# Altium project USB-TO-UART.PrjPCB
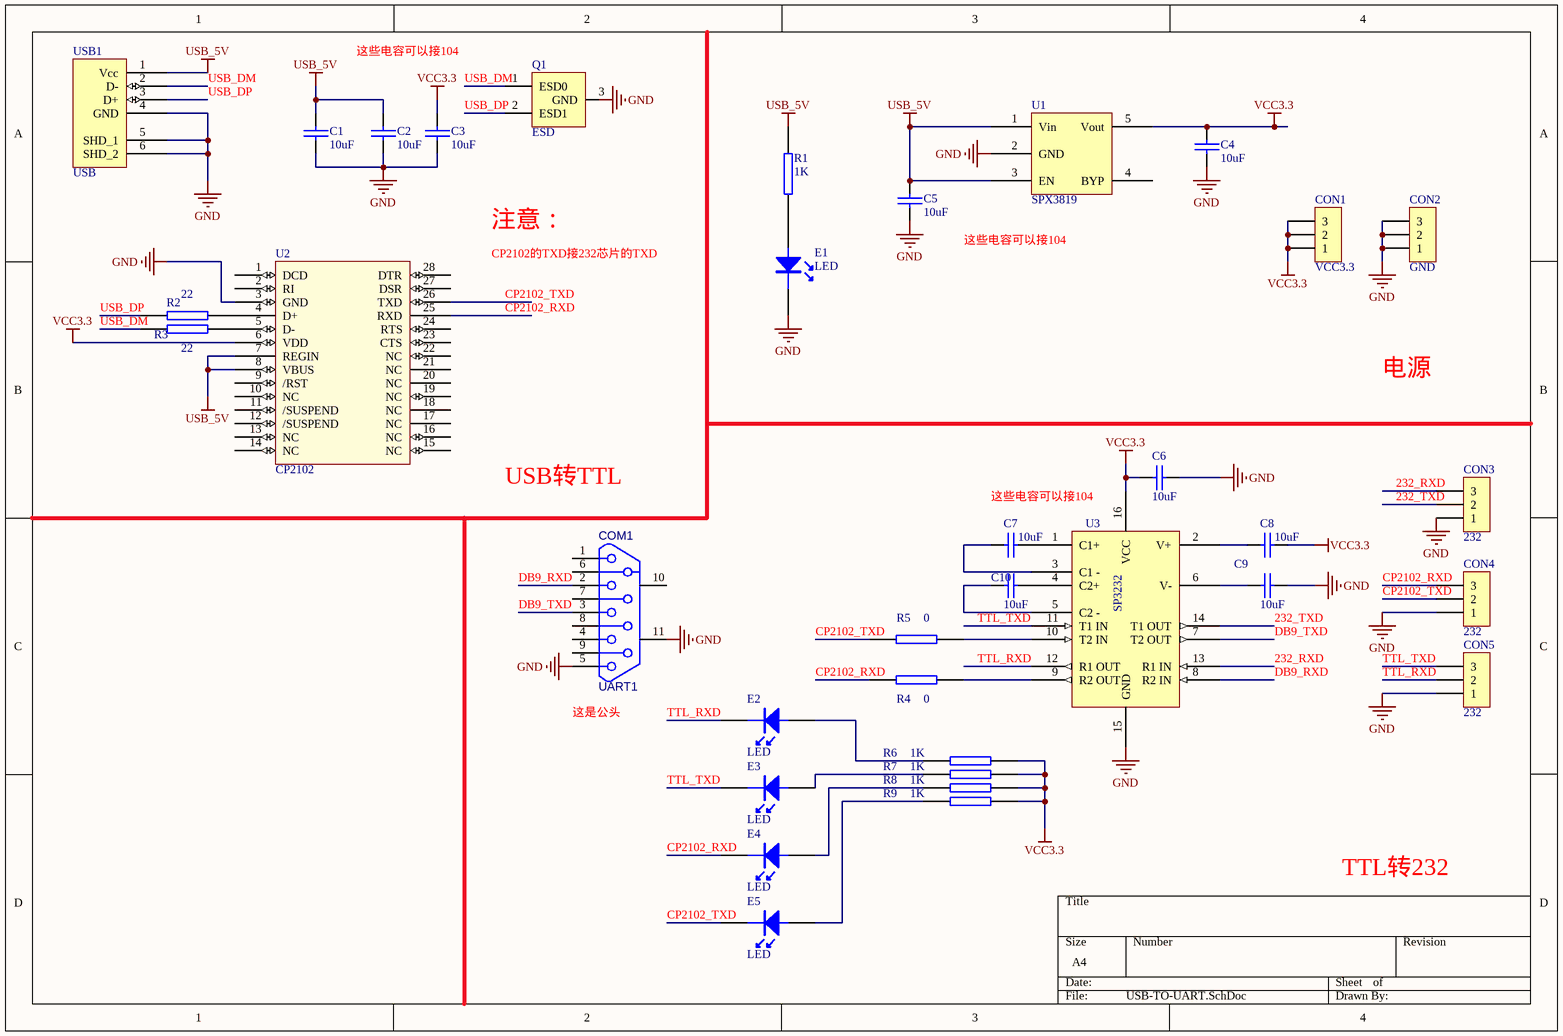
[diagram p0: USB-TO-UART.SchDoc]
1 sheet, 35 parts. Net scope: global (net labels, ports and power ports of the same name join across sheets).
Board file: USB-TO-UART.PcbDoc

## Sheet USB-TO-UART.SchDoc
size A4

### Parts
C1  10uF  [0603]
C2  10uF  [0603]
C3  10uF  [0603]
C4  10uF  [0603]
C5  10uF  [0603]
C6  10uF  [0603]
C7  10uF  [0603]
C8  10uF  [0603]
C9  10uF  [0603]
C10  10uF  [0603]
COM1  UART1  [DB9-Male]
CON1  VCC3.3  [3 pin]
CON2  GND  [3 pin]
CON3  232  [3 pin]
CON4  232  [3 pin]
CON5  232  [3 pin]
E1  LED  [LED_0603L]
E2  LED  [LED_0603L]
E3  LED  [LED_0603L]
E4  LED  [LED_0603L]
E5  LED  [LED_0603L]
Q1  ESD  [SOT32-809]
R1  1K  [0603]
R2  22  [0603]
R3  22  [0603]
R4  0  [0603]
R5  0  [0603]
R6  1K  [0603]
R7  1K  [0603]
R8  1K  [0603]
R9  1K  [0603]
U1  SPX3819  [SOT-23-5]
U2  CP2102  [QFN28]
U3  SP3232  [SO16]
USB1  USB  [USB-TB]

### Nets
GND: C1.2 C2.2 C3.2 C4.2 C5.2 C6.2 C9.2 COM1.5 COM1.11 CON2.1 CON2.2 CON2.3 CON3.1 CON4.1 CON5.1 E1.2 U1.2(GND) U2.3(GND) U3.15(GND) USB1.4(GND) USB1.5(SHD_1) USB1.6(SHD_2)
USB_5V: C1.1 C2.1 C5.1 R1.2 U1.1(Vin) U1.3(EN) U2.7(REGIN) U2.8(VBUS) USB1.1(Vcc)
VCC3.3: C3.1 C4.1 C6.1 C8.2 CON1.1 CON1.2 CON1.3 R6.2 R7.2 R8.2 R9.2 U1.5(Vout) U2.6(VDD) U3.16(VCC)
232_RXD: CON3.3 U3.13(R1_IN)
232_TXD: CON3.2 U3.14(T1_OUT)
CP2102_RXD: CON4.3 E4.2 R4.1 U2.25(RXD)
CP2102_TXD: CON4.2 E5.2 R5.1 U2.26(TXD)
DB9_RXD: COM1.2 U3.8(R2_IN)
DB9_TXD: COM1.3 U3.7(T2_OUT)
TTL_RXD: CON5.2 E2.2 U3.12(R1_OUT)
TTL_TXD: CON5.3 E3.2 U3.11(T1_IN)
USB_DM: Q1.1(ESD0) R3.1 USB1.2(D-)
USB_DP: Q1.2(ESD1) R2.1 USB1.3(D+)
NetC7_1: C7.1 U3.3(C1_-)
NetC7_2: C7.2 U3.1(C1+)
NetC8_1: C8.1 U3.2(V+)
NetC9_1: C9.1 U3.6(V-)
NetC10_1: C10.1 U3.4(C2+)
NetC10_2: C10.2 U3.5(C2_-)
NetE1_1: E1.1 R1.1
NetE2_1: E2.1 R6.1
NetE3_1: E3.1 R7.1
NetE4_1: E4.1 R8.1
NetE5_1: E5.1 R9.1
NetR2_2: R2.2 U2.4(D+)
NetR3_2: R3.2 U2.5(D-)
NetR4_2: R4.2 U3.9(R2_OUT)
NetR5_2: R5.2 U3.10(T2_IN)

Not connected (* = marked no-connect by the designer): COM1 1 4 6 7 8 9 10; Q1 3(GND); U1 4(BYP); U2 1(DCD) 2(RI) 9(/RST) 10(NC) 11(/SUSPEND) 12(/SUSPEND) 13(NC) 14(NC) 15(NC) 16(NC) 17(NC) 18(NC) 19(NC) 20(NC) 21(NC) 22(NC) 23(CTS) 24(RTS) 27(DSR) 28(DTR)

### Notes on the sheet
- 这些电容可以接104
- 注意：
- CP2102的TXD接232芯片的TXD
- 电源
- USB转TTL
- (near COM1) 这是公头
- TTL转232
- Labels drawn without touching a wire or pin: GND

### Library data of the parts
C1-C10 = CAP Nonpolarity: 无极电容
COM1 = DB9: 串口接口
CON1-CON5 = CON3: 3 pin
E1-E5 = LED: LED灯
Q1 = ESD: PESD1CAN
R1-R9 = R: 电阻
U1 = SPX3819: 稳压器
U2 = CP2102: usb转usart
U3 = SP3232: 232IC